# EAGLE schematic RocMan (EAGLE 9.6.2)
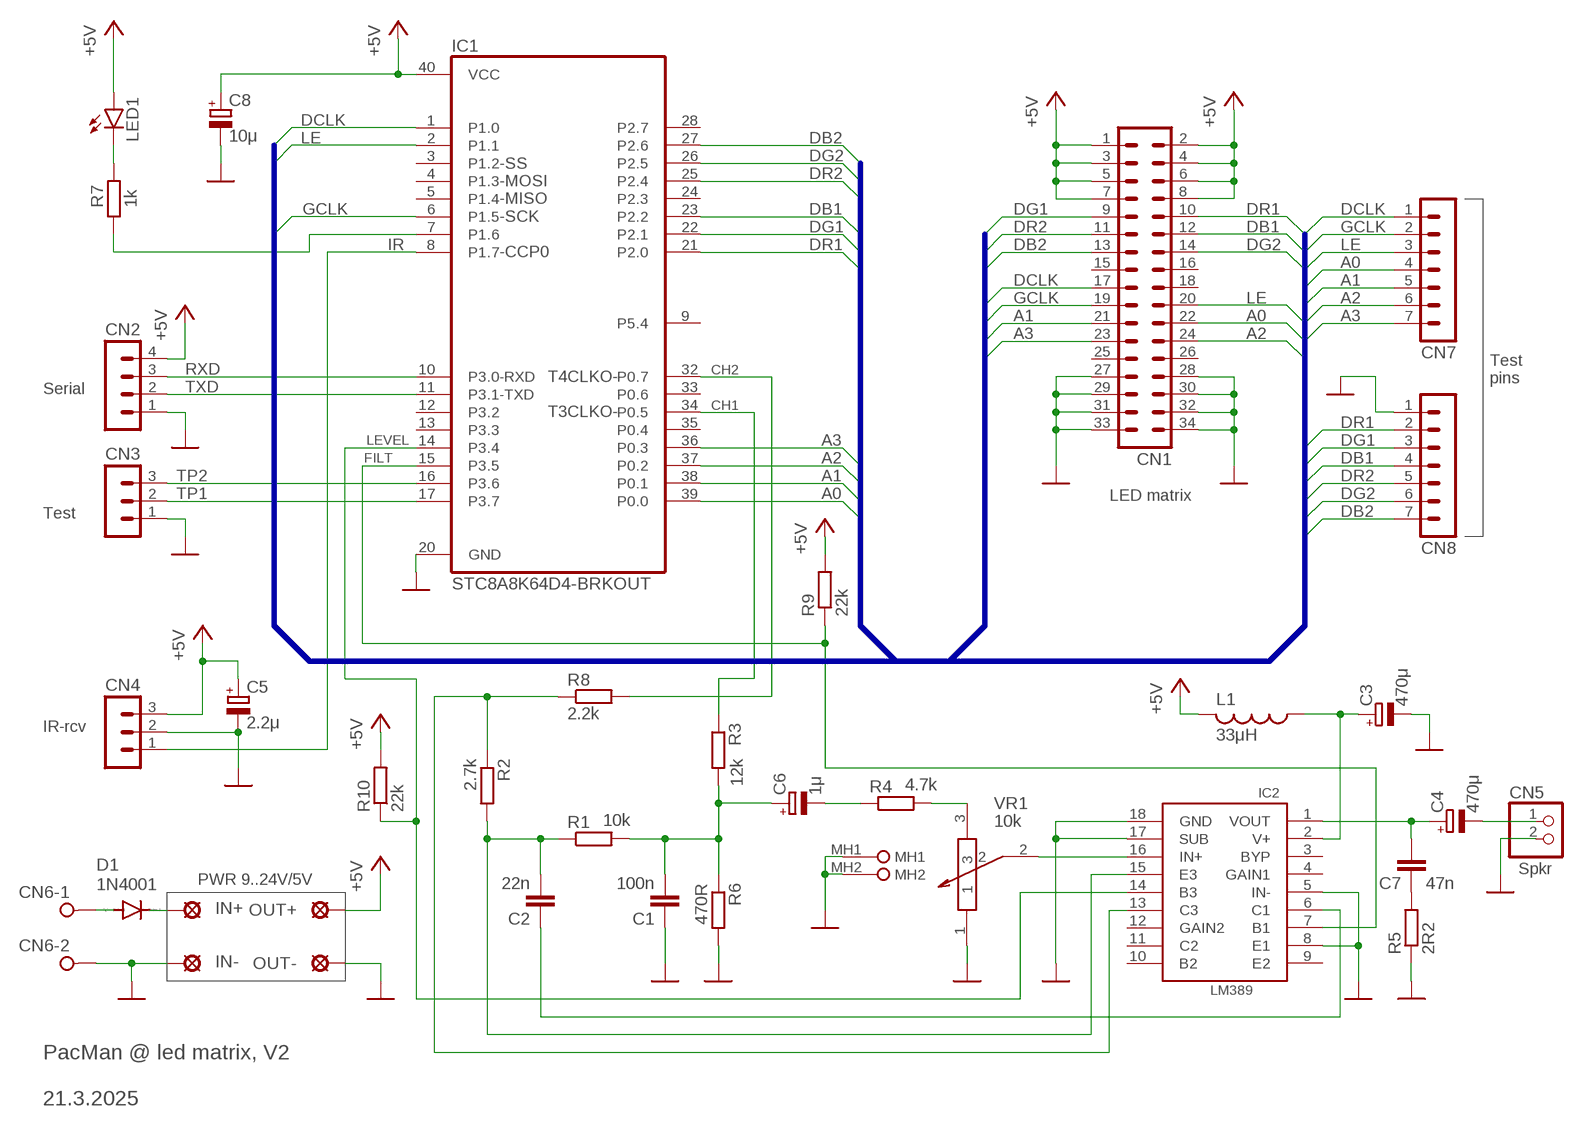
[diagram p0: schematic, sheet 1]

## Parts
C1  100n  C-EUC0805  [C0805]
C2  22n  C-EUC0805  [C0805]
C3  470μ  CPOL-EUE5-10.5  [E5-10,5]
C4  470μ  CPOL-EUE5-10.5  [E5-10,5]
C5  2.2μ  CPOL-EUSMCA  [SMC_A]
C6  1μ  CPOL-EUSMCA  [SMC_A]
C7  47n  C-EUC0805  [C0805]
C8  10μ  CPOL-EUSMCA  [SMC_A]
CN1  ML34  [ML34]
CN2  MA04-1  [MA04-1]
CN3  MA03-1  [MA03-1]
CN4  MA03-1  [MA03-1]
CN5  PINHD-1X2  [1X02]
CN6  W237-02P  [W237-132]
CN7  MA07-1  [MA07-1]
CN8  MA07-1  [MA07-1]
D1  1N4001  1N4004  [DO41-10]
IC1  STC8A8K64D4-BRKOUT  [DIL40]
IC2  LM389  [DIL18]
IN+  LSP11  [LSP11]
IN-  LSP11  [LSP11]
L1  33μH  L-USL4532C  [L4532M]
LED1  LEDCHIP-LED0805  [CHIP-LED0805]
OUT+  LSP11  [LSP11]
OUT-  LSP11  [LSP11]
R1  10k  R-EU_R0805  [R0805]
R2  2.7k  R-EU_R0805  [R0805]
R3  12k  R-EU_R0805  [R0805]
R4  4.7k  R-EU_R0805  [R0805]
R5  2R2  R-EU_R0805  [R0805]
R6  470R  R-EU_R0805  [R0805]
R7  1k  R-EU_R0805  [R0805]
R8  2.2k  R-EU_R0805  [R0805]
R9  22k  R-EU_R0805  [R0805]
R10  22k  R-EU_R0805  [R0805]
VR1  10k  PTV09A-4015F-A103  [PTV09A4015FA103]

## Nets
+5V: C5.+ C8.+ CN1.1 CN1.2 CN1.3 CN1.4 CN1.5 CN1.6 CN1.7 CN1.8 CN2.4 CN4.3 IC1.40(VCC) L1.2 LED1.A OUT+.MP R9.2 R10.2
A0: CN1.22 CN7.4 IC1.39(P0.0)
A1: CN1.21 CN7.5 IC1.38(P0.1)
A2: CN1.24 CN7.6 IC1.37(P0.2)
A3: CN1.23 CN7.7 IC1.36(P0.3)
CH1: IC1.34(P0.5) R3.1
CH2: IC1.32(P0.7) R8.2
DB1: CN1.12 CN8.4 IC1.23(P2.2)
DB2: CN1.13 CN8.7 IC1.27(P2.6)
DCLK: CN1.17 CN7.1 IC1.1(P1.0)
DG1: CN1.9 CN8.3 IC1.22(P2.1)
DG2: CN1.14 CN8.6 IC1.26(P2.5)
DR1: CN1.10 CN8.2 IC1.21(P2.0)
DR2: CN1.11 CN8.5 IC1.25(P2.4)
FILT: IC1.15(P3.5) IC2.7(B1) R9.1
GCLK: CN1.19 CN7.2 IC1.6(P1.5)
GND: C1.1 C3.- C5.- C8.- CN1.27 CN1.28 CN1.29 CN1.30 CN1.31 CN1.32 CN1.33 CN1.34 CN2.1 CN3.1 CN4.2 CN5.2 CN6.2 CN8.1 IC1.20(GND) IC2.5(IN-) IC2.8(E1) IC2.17(SUB) IC2.18(GND) IN-.MP OUT-.MP R5.1 R6.2 VR1.1 VR1.MH1 VR1.MH2
IR: CN4.1 IC1.8(P1.7)
LE: CN1.20 CN7.3 IC1.2(P1.1)
LEVEL: IC1.14(P3.4) IC2.14(B3) R10.1
N$1: C2.2 IC2.15(E3) R1.1 R2.2
N$2: C1.2 C6.+ R1.2 R3.2 R6.1
N$3: C2.1 IC2.6(C1)
N$4: C6.- R4.1
N$5: R4.2 VR1.3
N$6: IC2.13(C3) R2.1 R8.1
N$7: IC2.16(IN+) VR1.2
N$8: C3.+ IC2.2(V+) L1.1
N$9: CN6.1 D1.A
N$10: C4.+ C7.2 IC2.1(VOUT)
N$11: C4.- CN5.1
N$12: D1.C IN+.MP
N$13: C7.1 R5.2
N$14: IC1.7(P1.6) R7.1
N$15: LED1.C R7.2
RXD: CN2.3 IC1.10(P3.0-RXD)
TP1: CN3.2 IC1.17(P3.7)
TP2: CN3.3 IC1.16(P3.6)
TXD: CN2.2 IC1.11(P3.1-TXD)
Unconnected: CN1.15 CN1.16 CN1.18 CN1.25 CN1.26 IC1.3(P1.2) IC1.4(P1.3) IC1.5(P1.4) IC1.9(P5.4) IC1.12(P3.2) IC1.13(P3.3) IC1.24(P2.3) IC1.28(P2.7) IC1.33(P0.6) IC1.35(P0.4) IC2.3(BYP) IC2.4(GAIN1) IC2.9(E2) IC2.10(B2) IC2.11(C2) IC2.12(GAIN2)

## Buses
A0,A1,A2,A3,DB1,DB2,DCLK,DG1,DG2,DR1,DR2,GCLK,LE

## Notes on the sheet
- -SS
  -MOSI
  -MISO
  -SCK
- -CCP0
- Test
  pins
- Serial
- T4CLKO-
  
  T3CLKO-
- LED matrix
- Test
- IR-rcv
- Spkr
- PWR 9..24V/5V
- PacMan @ led matrix, V2
  
  21.3.2025

## Library data of the parts
C1 C2 C7 = rcl:C-EU: CAPACITOR, European symbol; SPICEPREFIX: C
C3-C6 C8 = rcl:CPOL-EU: POLARIZED CAPACITOR, European symbol; SPICEPREFIX: C
CN1 = con-harting-ml:ML34: HARTING; OC_FARNELL: unknown; OC_NEWARK: unknown
CN2 = con-lstb:MA04-1: PIN HEADER; OC_FARNELL: unknown; OC_NEWARK: unknown
CN3 CN4 = con-lstb:MA03-1: PIN HEADER; OC_FARNELL: unknown; OC_NEWARK: unknown
CN5 = pinhead:PINHD-1X2: PIN HEADER
CN6 = con-wago-508:W237-02P: WAGO SREW CLAMP; OC_FARNELL: unknown; OC_NEWARK: unknown
CN7 CN8 = con-lstb:MA07-1: PIN HEADER; OC_FARNELL: unknown; OC_NEWARK: unknown
D1 = diode:1N4004: DIODE general purpose rectifier, 1 A
IC1 = stc-omat:STC8A8K64D4-BRKOUT: STC8A8K64D4/QFP48 @ DIP-40 breakout from eBay
IC2 = omat-muut:LM389
IN+ IN- OUT+ OUT- = solpad:LSP11: SOLDER PAD drill 1.1 mm
L1 = rcl:L-US: INDUCTOR, American symbol; SPICEPREFIX: L
LED1 = led:LED: LED OSRAM: - CHIPLED LG R971, LG N971, LY N971, LG Q971, LY Q971, LO R971, LY R971 LH N974, LH R974 LS Q976, LO Q976, LY Q976 LO Q996 - Hyper CHIPLED LW Q18S LB Q993, LB Q99A, LB R99A - SideLED LS A670, LO A670, LY A670, LG A670, LP A670 LB A673, LV A673, LT A673, LW A673 LH A674 LY A675 LS A676, LA A676, LO A676, LY A676, LW A676 LS A679, LY A679, LG A679 - Hyper Micro SIDELED® LS Y876, LA Y876, LO Y876, LY Y876 LT Y87S - SmartLED LW L88C, LW L88S LB L89C, LB L89S, LG L890 LS L89K, LO L89K, LY L89K LS L896, LA L896, LO L896, LY L896 - TOPLED LS T670, LO T670, LY T670, LG T670, LP T670 LSG T670, LSP T670, LSY T670, LOP T670, LYG T670 LG T671, LOG T671, LSG T671 LB T673, LV T673, LT T673, LW T673 LH T674 LS T676, LA T676, LO T676, LY T676, LB T676, LH T676, LSB T676, LW T676 LB T67C, LV T67C, LT T67C, LS T67K, LO T67K, LY T67K, LW E67C LS E67B, LA E67B, LO E67B, LY E67B, LB E67C, LV E67C, LT E67C LW T67C LS T679, LY T679, LG T679 LS T770, LO T770, LY T770, LG T770, LP T770 LB T773, LV T773, LT T773, LW T773 LH T774 LS E675, LA E675, LY E675, LS T675 LS T776, LA T776, LO T776, LY T776, LB T776 LHGB T686 LT T68C, LB T68C - Hyper Mini TOPLED® LB M676 - Mini TOPLED Santana® LG M470 LS M47K, LO M47K, LY M47K Source: http://www.osram.convergy.de LUXEON: - LUMILED® LXK2-PW12-R00, LXK2-PW12-S00, LXK2-PW14-U00, LXK2-PW14-V00 LXK2-PM12-R00, LXK2-PM12-S00, LXK2-PM14-U00 LXK2-PE12-Q00, LXK2-PE12-R00, LXK2-PE12-S00, LXK2-PE14-T00, LXK2-PE14-U00 LXK2-PB12-K00, LXK2-PB12-L00, LXK2-PB12-M00, LXK2-PB14-N00, LXK2-PB14-P00, LXK2-PB14-Q00 LXK2-PR12-L00, LXK2-PR12-M00, LXK2-PR14-Q00, LXK2-PR14-R00 LXK2-PD12-Q00, LXK2-PD12-R00, LXK2-PD12-S00 LXK2-PH12-R00, LXK2-PH12-S00 LXK2-PL12-P00, LXK2-PL12-Q00, LXK2-PL12-R00 Source: www.luxeon.com KINGBRIGHT: KA-3528ASYC Source: www.kingbright.com
R1-R10 = rcl:R-EU_: RESISTOR, European symbol; SPICEPREFIX: R
VR1 = omat-muut:PTV09A-4015F-A103: Potentiometers 10K AUDIO 20% Source: Datasheet <https://www.bourns.com/docs/Product-Datasheets/PTV09.pdf>; DESCRIPTION: Potentiometers 10K AUDIO 20%; HEIGHT: 15.5mm; MANUFACTURER_NAME: Bourns; MANUFACTURER_PART_NUMBER: PTV09A-4015F-A103; MOUSER_PART_NUMBER: 652-PTV09A-4015FA103; MOUSER_PRICE-STOCK: https://www.mouser.co.uk/ProductDetail/Bourns/PTV09A-4015F-A103?qs=Qzws7J6gxqwyx8aBn%2Flmmw%3D%3D